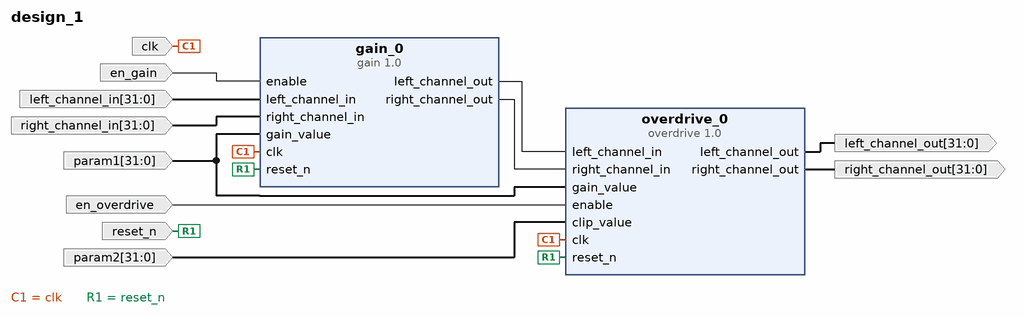
[diagram p0: block diagram of the top level]
# Vivado block design design_1, xc7z010clg400-1, Vivado 2021.1
create_bd_design design_1

create_bd_port -dir I -from 31 -to 0 -type data left_channel_in
create_bd_port -dir I -from 31 -to 0 -type data right_channel_in
create_bd_port -dir I -type clk clk
set_property -dict {CONFIG.FREQ_HZ 50000000} [get_bd_ports clk]
create_bd_port -dir I -type rst reset_n
create_bd_port -dir I -from 31 -to 0 -type data param1
create_bd_port -dir I -from 31 -to 0 -type data param2
create_bd_port -dir O -from 31 -to 0 -type data left_channel_out
create_bd_port -dir O -from 31 -to 0 -type data right_channel_out
create_bd_port -dir I en_gain
create_bd_port -dir I en_overdrive

create_bd_cell -type ip -vlnv xilinx.com:user:overdrive:1.0 overdrive_0
create_bd_cell -type ip -vlnv xilinx.com:user:gain:1.0 gain_0

# ---- connections ----

connect_bd_net [get_bd_ports clk] [get_bd_pins gain_0/clk] [get_bd_pins overdrive_0/clk]
connect_bd_net [get_bd_ports en_gain] [get_bd_pins gain_0/enable]
connect_bd_net [get_bd_ports en_overdrive] [get_bd_pins overdrive_0/enable]
connect_bd_net [get_bd_pins gain_0/left_channel_out] [get_bd_pins overdrive_0/left_channel_in]
connect_bd_net [get_bd_pins gain_0/right_channel_out] [get_bd_pins overdrive_0/right_channel_in]
connect_bd_net [get_bd_ports left_channel_in] [get_bd_pins gain_0/left_channel_in]
connect_bd_net [get_bd_pins overdrive_0/left_channel_out] [get_bd_ports left_channel_out]
connect_bd_net [get_bd_pins overdrive_0/right_channel_out] [get_bd_ports right_channel_out]
connect_bd_net -net param1_1 [get_bd_ports param1] [get_bd_pins gain_0/gain_value] [get_bd_pins overdrive_0/gain_value]
connect_bd_net -net param2_1 [get_bd_ports param2] [get_bd_pins overdrive_0/clip_value]
connect_bd_net [get_bd_ports reset_n] [get_bd_pins gain_0/reset_n] [get_bd_pins overdrive_0/reset_n]
connect_bd_net [get_bd_ports right_channel_in] [get_bd_pins gain_0/right_channel_in]

validate_bd_design
save_bd_design
